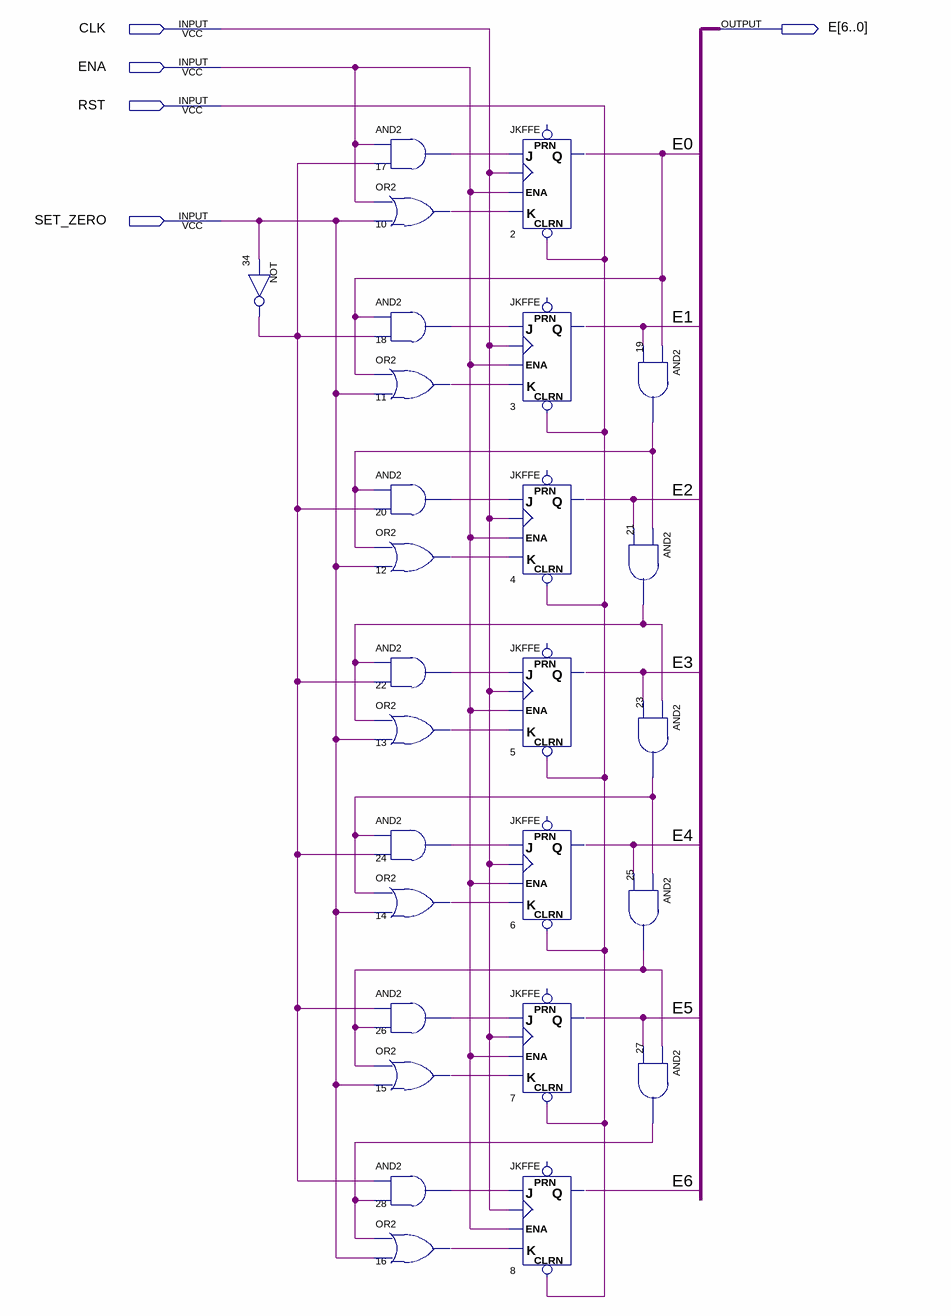
[diagram p0: schematic sheet]
// Quartus schematic cntr7.bdf as structural Verilog: 27 symbols, 5 pins
module cntr7 (
  input  CLK,
  input  ENA,
  input  RST,
  input  SET_ZERO,
  output [6:0] E
);

  wire n10_out, n11_out, n12_out, n13_out, n14_out, n15_out, n16_out, n17_out, n18_out, n19_out, n20_out,
       n21_out, n22_out, n23_out, n24_out, n25_out, n26_out, n27_out, n28_out, n34_out;

  not u_34 (n34_out, SET_ZERO);
  and u_17 (n17_out, ENA, n34_out);
  or u_10 (n10_out, ENA, SET_ZERO);
  and u_18 (n18_out, E[0], n34_out);
  or u_11 (n11_out, E[0], SET_ZERO);
  and u_20 (n20_out, n19_out, n34_out);
  or u_12 (n12_out, n19_out, SET_ZERO);
  and u_22 (n22_out, n21_out, n34_out);
  or u_13 (n13_out, n21_out, SET_ZERO);
  and u_24 (n24_out, n23_out, n34_out);
  or u_14 (n14_out, n23_out, SET_ZERO);
  and u_26 (n26_out, n34_out, n25_out);
  or u_15 (n15_out, n25_out, SET_ZERO);
  and u_28 (n28_out, n34_out, n27_out);
  or u_16 (n16_out, n27_out, SET_ZERO);
  JKFFE u_2 (.J(n17_out), .CLK(CLK), .CLRN(RST), .K(n10_out), .ENA(ENA), .Q(E[0]));  // open: PRN
  JKFFE u_3 (.J(n18_out), .CLK(CLK), .CLRN(RST), .K(n11_out), .ENA(ENA), .Q(E[1]));  // open: PRN
  JKFFE u_4 (.J(n20_out), .CLK(CLK), .CLRN(RST), .K(n12_out), .ENA(ENA), .Q(E[2]));  // open: PRN
  JKFFE u_5 (.J(n22_out), .CLK(CLK), .CLRN(RST), .K(n13_out), .ENA(ENA), .Q(E[3]));  // open: PRN
  JKFFE u_6 (.J(n24_out), .CLK(CLK), .CLRN(RST), .K(n14_out), .ENA(ENA), .Q(E[4]));  // open: PRN
  JKFFE u_7 (.J(n26_out), .CLK(CLK), .CLRN(RST), .K(n15_out), .ENA(ENA), .Q(E[5]));  // open: PRN
  JKFFE u_8 (.J(n28_out), .CLK(CLK), .CLRN(RST), .K(n16_out), .ENA(ENA), .Q(E[6]));  // open: PRN
  and u_19 (n19_out, E[0], E[1]);
  and u_21 (n21_out, n19_out, E[2]);
  and u_23 (n23_out, n21_out, E[3]);
  and u_25 (n25_out, n23_out, E[4]);
  and u_27 (n27_out, n25_out, E[5]);
endmodule
